# Altium schematic sheet USB_PD.SchDoc
size A4; SheetNumber: 1; SheetTotal: 4
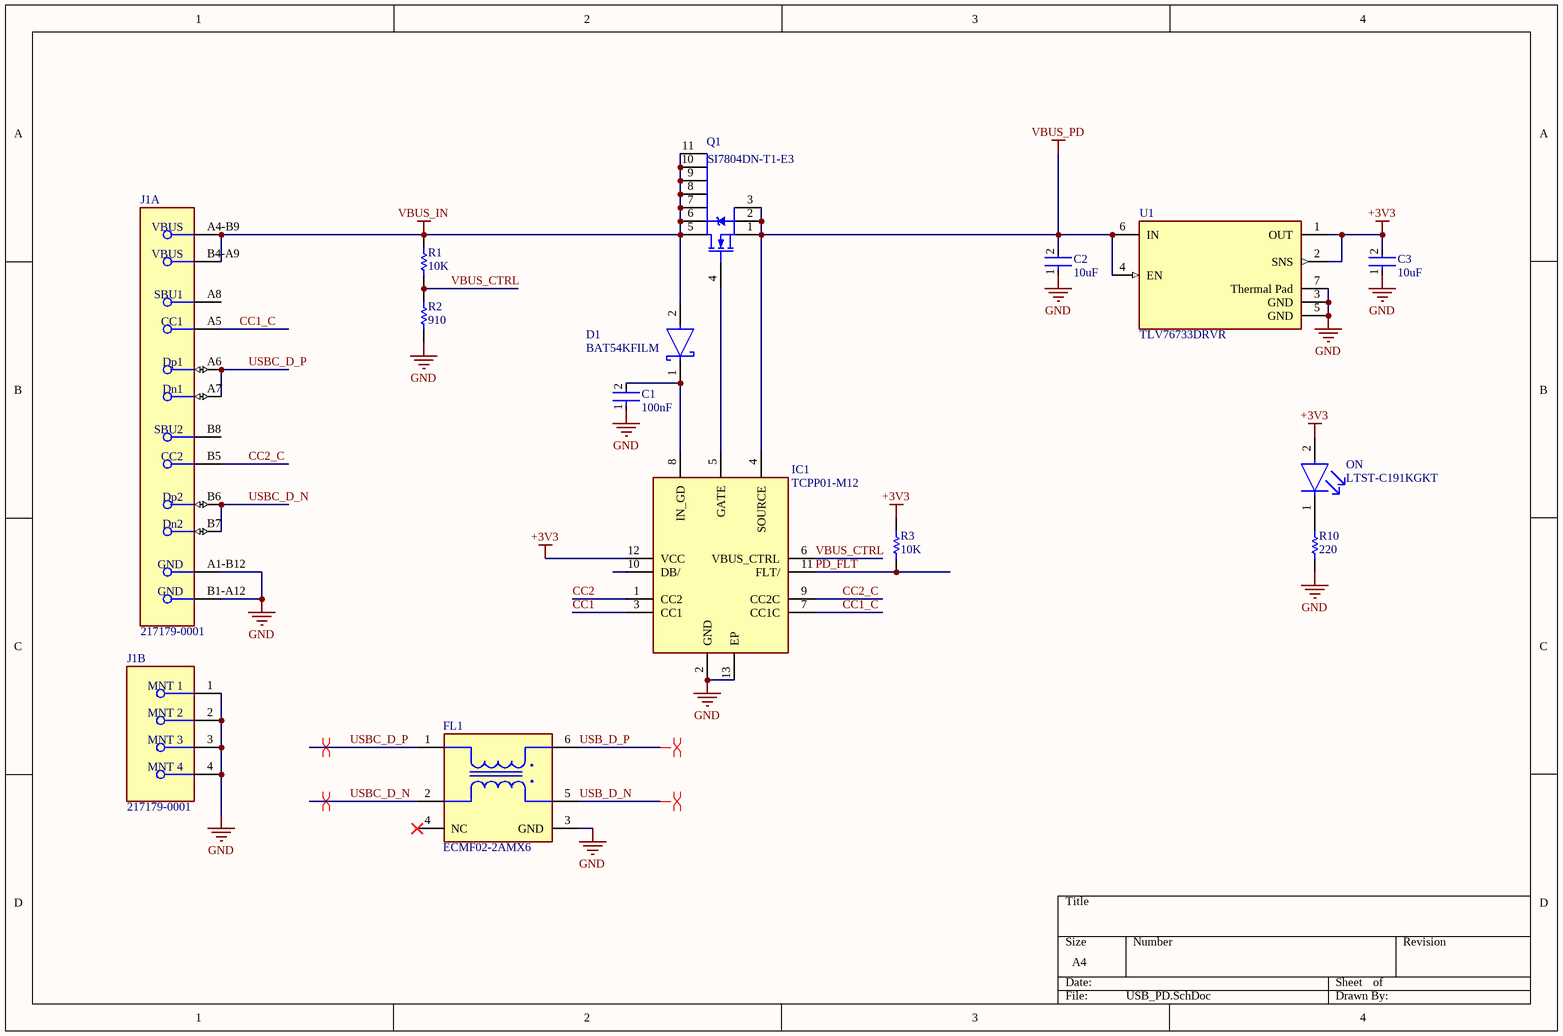
[diagram p0: USB_PD.SchDoc]

## Parts
C1  Capacitance: 100nF  [FP-C1005-050-0_05-IPC_C]  (hidden comment: C1005X7R1H104K050BB)
C2  Capacitance: 10uF  [FP-C1608-080-IPC_A]  (hidden comment: C1608X5R1E106M080AC)
C3  Capacitance: 10uF  [FP-C1608-080-IPC_A]  (hidden comment: C1608X5R1E106M080AC)
D1  BAT54KFILM  [FP-SOD-523-MFG]
FL1  ECMF02-2AMX6  [FP-QFN-6L-MFG]
IC1  TCPP01-M12  [QFN50P300X300X100-13N-D]
J1  217179-0001  [FP-2171790001-MFG]  (parts A,B of 2)
ON  LTST-C191KGKT  [FP-LTST-C191KGKT-MFG]
Q1  SI7804DN-T1-E3  [SIS862DNT1GE3]
R1  Resistance: 10K  [RESC1005X40X25ML05T05]  (hidden comment: ERJ-2GEJ103X)
R2  ERJ-2GEJ103X: 910  [RESC1005X40X25ML05T05]  (hidden comment: ERJ-2GEJ911X)
R3  Resistance: 10K  [RESC1005X40X25ML05T05]  (hidden comment: ERJ-2GEJ103X)
R10  Resistance: 220  [RESC1005X40X25LL05T05]  (hidden comment: ERJ2RKF2200X)
U1  TLV76733DRVR  [FP-DRV0006A-IPC_C]

## Nets
+3V3: C3.2 IC1.12(VCC) ON.2(A) R3.2 U1.1(OUT) U1.2(SNS)
GND: C1.1 C2.1 C3.1 FL1.3(GND) IC1.2(GND) IC1.13(EP) J1.1(MNT_1) J1.2(MNT_2) J1.3(MNT_3) J1.4(MNT_4) J1.A1-B12(GND) J1.B1-A12(GND) R2.1 R10.2 U1.3(GND) U1.5(GND) U1.7(Thermal_Pad)
VBUS_IN: D1.2(A) J1.A4-B9(VBUS) J1.B4-A9(VBUS) Q1.5(D_1) Q1.6(D_2) Q1.7(D_3) Q1.8(D_4) Q1.9(D_5) Q1.10(D_6) Q1.11(D_7) R1.2
VBUS_PD: C2.2 IC1.4(SOURCE) Q1.1(S_1) Q1.2(S_2) Q1.3(S_3) U1.4(EN) U1.6(IN)
CC1: IC1.3(CC1)
CC1_C: IC1.7(CC1C) J1.A5(CC1)
CC2: IC1.1(CC2)
CC2_C: IC1.9(CC2C) J1.B5(CC2)
PD_~{FLT}: IC1.11(FLT/) R3.1
USB_D_N: FL1.5(D-)
USB_D_P: FL1.6(D+)
USBC_D_N: FL1.2(D-) J1.B6(Dp2) J1.B7(Dn2)
USBC_D_P: FL1.1(D+) J1.A6(Dp1) J1.A7(Dn1)
VBUS_CTRL: IC1.6(VBUS_CTRL) R1.1 R2.2
NetC1_2: C1.2 D1.1(C) IC1.8(IN_GD)
NetIC1_5: IC1.5(GATE) Q1.4(G)
NetON_1: ON.1(C) R10.1

Not connected (* = marked no-connect by the designer): FL1 4(NC)*; IC1 10(DB/); J1 A8(SBU1) B8(SBU2)

## Layout directives
differential pair: USB_D_N, USB_D_P, USBC_D_N, USBC_D_P

## Library data of the parts
C1 = CMP-2000-05393-2: Multilayer Ceramic Capacitors 100nF ±10% 50V X7R SMD 0402; Voltage: 50V; Dielectric Material: Ceramic; Min Operating Temperature: -55°C; Depth: 0.5mm; Radiation Hardening: No; RoHS Compliant: Yes; Voltage Rating (DC): 50V; Lead Free: Lead Free; Resistor Type: Ceramic; Height: 0.5mm; Dielectric: X7R; Thickness: 0.022inch; Case/Package: 0402; Case Code (Metric): 1005; Termination: SMD/SMT; Packaging: Tape and Reel; Max Operating Temperature: 125°C; Mount: Surface Mount; Package Quantity: 1; Width: 0.02inch; Weight: 2.3E-05oz; Voltage Rating: 50V; Tolerance: 10%; Construction: Flat; Case Code (Imperial): 0402; Length: 1mm; REACH SVHC: No SVHC; Series: C
C2 C3 = CMP-2000-05442-2: CAP CER 10UF 25V X5R 0603; Dielectric Material: Ceramic; Tolerance: 20%; Dielectric: X5R; Length: 1.6mm; Termination: SMD/SMT; Depth: 0.8mm; RoHS Compliant: Yes; Construction: Flat; Weight: 7.1E-05oz; Thickness: 0.039inch; Packaging: Tape and Reel; Min Operating Temperature: -55°C; Case Code (Imperial): 0603; Case/Package: 0603; Height: 0.8mm; Case Code (Metric): 1608; Voltage Rating: 25V; Resistor Type: Ceramic; Voltage Rating (DC): 25V; Max Operating Temperature: 85°C; REACH SVHC: No SVHC; Lead Free: Lead Free; Series: C; Width: 0.8mm; Mount: Surface Mount; Package Quantity: 1
D1 = CMP-12187-000026-1: DIODE SCHOTTKY 40V 300MA SOD523; Manufacturer: STMicroelectronics; Capacitance: 7pF; Value: 7pF; Max Surge Forward Current: 1.25A; Peak Reverse Current: 1uA; Max Junction Temp: +150°C; Device Class L2: Diodes; Temperature Range Low: -40°C; Category: Diode; Manufacturer Part Number: BAT54KFILM; Digikey Description: DIODE SCHOTTKY 40V 300MA SOD523; Device Class L3: Schottky Diodes; Automotive: No; Height: 0.7mm; Octopart: https://octopart.com/bat54kfilm-stmicroelectronics-39618022; ComponentLink2Description: Datasheet; Temperature Range High: +150°C; Device Class L1: Discrete Semiconductors; Max Repetitive Reverse Voltage: 40V; RoHS: TRUE; Temperature: -40°C to +150°C; ComponentLink2URL: https://www.st.com/content/ccc/resource/technical/document/datasheet/07/50/54/f2/0d/ba/4a/79/CD00001322.pdf/files/CD00001322.pdf/jcr:content/translations/en.CD00001322.pdf; Lead Free: Yes; Forward Current: 300mA; Package: SOD-523; Mouser Description: Schottky Diodes & Rectifiers schottky diode
FL1 = CMP-12075-000001-1: CMC 200MA 2LN SMD ESD; Manufacturer: STMicroelectronics; Standoff Height: 0mm; Max Junction Temp: +125°C; Series Resistance: 2.5Ω; Device Class L2: EMI / RFI Components; Device Class L1: Passive Components; Height: 0.55mm; Lead Free: Yes; Package: QFN-6L; Temperature Range Low: -55°C; Octopart: https://octopart.com/ecmf02-2amx6-stmicroelectronics-44353078; Mouser Description: TVS Diodes / ESD Suppressors ESD Mode Filter 6GHz USB 2.0 MIPI 8kV; Device Class L3: Common Mode Chokes; ComponentLink2URL: https://www.st.com/resource/en/datasheet/ecmf02-2amx6.pdf; Ipc Land Pattern Name: DFN170X150X50-6; ComponentLink2Description: Datasheet; Automotive: No; Temperature Range High: +125°C; Temperature: -55°C to +125°C; RoHS: TRUE; Digikey Description: CMC 200MA 2LN SMD ESD; Manufacturer Part Number: ECMF02-2AMX6; Category: Filter
IC1 = TCPP01-M12: Integrated Circuit; Manufacturer_Name: STMicroelectronics; Datasheet Link: https://www.st.com/resource/en/datasheet/tcpp01-m12.pdf; Height: 1mm; Manufacturer_Part_Number: TCPP01-M12; Mouser Part Number: 511-TCPP01-M12; Mouser Price/Stock: https://www.mouser.co.uk/ProductDetail/STMicroelectronics/TCPP01-M12?qs=%252B6g0mu59x7KCafIwapwG2A%3D%3D; Arrow Part Number: TCPP01-M12; Arrow Price/Stock: https://www.arrow.com/en/products/tcpp01-m12/stmicroelectronics?utm_currency=USD&region=nac
J1 = CMP-04767-000028-2: CONN RCP USB2.0 TYP C 24P SMD RA; NexarPartId: 117190526; Gender: Receptacle; Number of Contacts: 16; Current Rating: 1.25A; Voltage Rating: 30V; Min Operating Temperature: -40°C; USB Standard: USB 2.0; Height: 3.36mm; Contact Material: Gold, Nickel; Max Operating Temperature: 85°C
ON = CMP-2000-05198-4: NexarPartId: 549907; Forward Voltage: 2V; Viewing Angle: 130°; Lens Transparency: Clear; Power Rating: 75mW; Number of LEDs: 1; Luminous Intensity: 35mcd; Forward Current: 20mA; Dominant Wavelength: 571nm; Illumination Color: Green; Lens Color: Clear, Colorless; Reverse Voltage: 5V; Wavelength: 574nm; Number of Pins: 2; Packaging: Tape and Reel; Number of Elements: 1; Schedule B: 8541402000, 8541402000; Height: 550µm; Case/Package: 0603; Depth: 800µm; Max Operating Temperature: 85°C; RoHS: Compliant; Lens Style: Clear; Lead Free: Lead Free; Length: 1.6mm; Mount: Surface Mount; Test Current: 20mA; Width: 800µm; Case Code (Imperial): 0603; Min Operating Temperature: -55°C; Case Code (Metric): 1608; Radiation Hardening: No; Power Dissipation: 75mW; Color: Green
Q1 = SI7804DN-T1-E3: MOSFET (N-Channel); Manufacturer_Name: Vishay; Datasheet Link: https://componentsearchengine.com/Datasheets/1/SI7804DN-T1-E3.pdf; Height: 1.12mm; Manufacturer_Part_Number: SI7804DN-T1-E3; Mouser Part Number: 781-SI7804DN-T1-E3; Mouser Price/Stock: https://www.mouser.co.uk/ProductDetail/Vishay-Semiconductors/SI7804DN-T1-E3?qs=jcx%252B0HVgj2biudZDRPx5dA%3D%3D; Arrow Part Number: SI7804DN-T1-E3; Arrow Price/Stock: https://www.arrow.com/en/products/si7804dn-t1-e3/vishay
R1 R3 = CMP-2002-00433-1: Manufacturer: Panasonic; Part Number: ERJ-2GEJ103X
R2 = CMP-1011-00073-2: Manufacturer: Panasonic; Part Number: ERJ-2GEJ911X
R10 = CMP-2002-01131-1: Manufacturer: Panasonic; Part Number: ERJ2RKF2200X
U1 = CMP-04917-000203-1: VOLTAGE COMPARATOR